# EAGLE schematic 5V power (EAGLE 9.6.2)
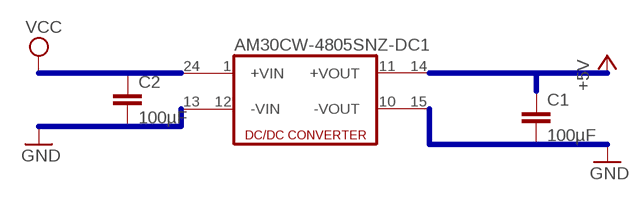
[diagram p0: schematic, sheet 1]

## Parts
AM30CW-4805SNZ-DC1  DC213R  [CMK]
C1  100µF  C5/2.5  [C5B2.5]
C2  100µF  C5/2.5  [C5B2.5]
Unconnected: AM30CW-4805SNZ-DC1.1(+VIN) AM30CW-4805SNZ-DC1.10(-VOUT) AM30CW-4805SNZ-DC1.11(+VOUT) AM30CW-4805SNZ-DC1.12(-VIN) AM30CW-4805SNZ-DC1.13(-VIN1) AM30CW-4805SNZ-DC1.14(+VOUT1) AM30CW-4805SNZ-DC1.15(-VOUT1) AM30CW-4805SNZ-DC1.24(+VIN1) C1.1 C1.2 C2.1 C2.2

## Buses
B$1
B$2
B$3
B$4

## Library data of the parts
AM30CW-4805SNZ-DC1 = dc-dc-converter:DC213R: DC-DC CONVERTER; OC_FARNELL: unknown; OC_NEWARK: unknown
C1 C2 = capacitor-wima:C: CAPACITOR naming: grid - package width